# Altium schematic sheet Periferals.SchDoc
size A; SheetNumber: 2; SheetTotal: 2
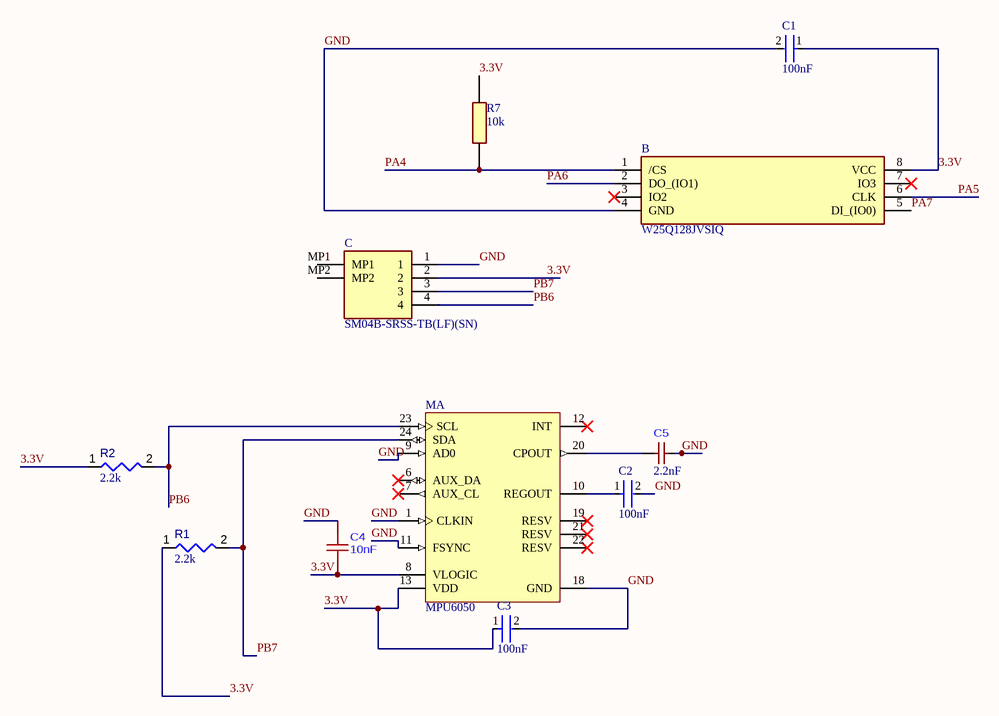
[diagram p0: Periferals.SchDoc]

## Parts
B  W25Q128JVSIQ  [SOIC127P790X216-8N]
C  SM04B-SRSS-TB(LF)(SN)  [SM04BSRSSTBLFSN]
C1  value 100nF  [FP-CC0603-DA-IPC_B]  (hidden comment: CC0603KRX7R9BB104)
C2  value 100nF  [FP-CC0603-DA-IPC_B]  (hidden comment: CC0603KRX7R9BB104)
C3  value 100nF  [FP-CC0603-DA-IPC_B]  (hidden comment: CC0603KRX7R9BB104)
C4  10nF  [PCBComponent_1]
C5  value 2.2nF  [PCBComponent_1]  (hidden comment: 0603B222K500NT)
M  MPU6050  [INSE-QFN-24_V]  (part A of 2)
R1  value 2.2k  [RESC0402(1005)_L]  (hidden comment: Resistor 2K2  +/-5 % 0402 63 mW)
R2  value 2.2k  [RESC0402(1005)_L]  (hidden comment: Resistor 2K2  +/-5 % 0402 63 mW)
R7  value 10k  [RESC1005X40N]  (hidden comment: 0402WGF1002TCE)

## Nets
3.3V: B.8(VCC) C.2 C1.1 C3.1 C4.1 M.8(VLOGIC) M.13(VDD) R1.1 R2.1 R7.2
GND: B.4(GND) C.1 C1.2 C2.2 C3.2 C4.2 C5.2 M.1(CLKIN) M.9(AD0) M.11(FSYNC) M.18(GND)
PA4: B.1(/CS) R7.1
PA5: B.6(CLK)
PA6: B.2(DO_(IO1))
PA7: B.5(DI_(IO0))
PB6: C.4 M.23(SCL) R2.2
PB7: C.3 M.24(SDA) R1.2
NetC2_1: C2.1 M.10(REGOUT)
NetC5_1: C5.1 M.20(CPOUT)

Not connected (* = marked no-connect by the designer): B 3(IO2)* 7(IO3)*; C MP1 MP2; M 6(AUX_DA)* 7(AUX_CL)* 12(INT)* 19(RESV)* 21(RESV)* 22(RESV)*

## Library data of the parts
B = CMP-00007-1: NOR Flash Serial (SPI, Dual SPI, Quad SPI) 3.3V 128M-bit 16M x 8 6ns 8-Pin SOIC Tube; Memory Size: 16MB; Nominal Supply Voltage (DC): 3V; Frequency: 104MHz; Number of Circuits: 1; Max Supply Voltage: 3.6V; Clock Frequency: 133MHz; Max Supply Current: 20mA; Min Supply Voltage: 2.7V; Export Control Classification Number (ECCN) Code: EAR99; China RoHS: Compliant; Case/Package: SOP; Max Operating Temperature: 85°C; Terminal Pitch: 1.27mm; Height - Seated (Max): 2.16mm; Min Operating Temperature: -40°C; Temperature Grade: Industrial; REACH SVHC: Yes; Lifecycle Status: Production; RoHS: Compliant; Number of Terminals: 8; Memory Format: FLASH; Harmonized Tariff Schedule (HTS) Code: 8542.32.00.51; Introduction Date: 2016-11-14; Ambient Temperature Range High: 85°C; Interface: Serial; Schedule B: 8542320070, 8542320070; Height: 2.16mm; Width: 5.23mm; Length: 5.23mm
C = CMP-00010-1: Connector Header, Side Entry, SR Series, 4 Position, 1.00mm, 50V, Surface Mount, Tin, Natural; Max Current Rating: 1A; Dielectric Material: Polyamide; Number of Positions: 4; Contact Resistance: 40mΩ; Pitch: 990.6µm; Connector Type: Male Pin; Gender: Male; Insulation Resistance: 100MΩ; Length: 6mm; Contact Plating: Tin; Orientation: Right Angle; Depth: 4.95mm; Packaging: Cut Tape; Max Operating Temperature: 85°C; Lifecycle Status: Production; Housing Material: Nylon; Lead Free: Lead Free; Mounting Technology: Surface Mount; Min Operating Temperature: -25°C; China RoHS: Compliant; Height: 2.9mm; Max Voltage Rating (AC): 50V; Current Rating: 1A; Pins: 2; Lead Pitch: 1mm; Color: Natural; Number of Contacts: 4; RoHS: Compliant; Width: 4.25mm; Voltage Rating: 50V; Housing Color: Natural; Termination: Solder; REACH SVHC: Yes; Number of Rows: 1; Max Voltage Rating (DC): 50V; Contact Material: Copper, Tin; Terminal Pitch: 1mm
C1-C3 = CMP-00034-1: Multilayer Ceramic Capacitor, CC Series, 0.1 - F, - 10%, X7R, 50 V, 0603 [1608 Metric]; Voltage Rating (DC): 50V; Schedule B: 8532240020, 8532240020; Harmonized Tariff Schedule (HTS) Code: 8532.24.00.20; Width: 800µm; RoHS: Compliant; Height: 800µm; Depth: 800µm; Termination: SMD/SMT; Lead Free: Lead Free; China RoHS: Compliant; Introduction Date: 2005-08-18; Dielectric: X7R; Case Code (Imperial): 0603; Export Control Classification Number (ECCN) Code: EAR99; Case/Package: 0603; Material: Ceramic; Number of Terminals: 2; Thickness: 889µm; Min Operating Temperature: -55°C; REACH SVHC: Yes; Mounting Technology: Surface Mount; Max Operating Temperature: 125°C; Dielectric Material: Ceramic; Halogen Free: Halogen Free; Voltage: 50V; Case Code (Metric): 1608; Length: 1.6mm; Lifecycle Status: Production; Tolerance: 10%; Voltage Rating: 50V; Radiation Hardening: No; Pins: 2; Country of Origin: Mainland China, Taiwan
C4 = CMP-00037-1: 50V 10nF X7R ±10% 0603 Multilayer Ceramic Capacitors MLCC - SMD/SMT ROHS; Number of Terminals: 2; Country of Origin: Mainland China; REACH SVHC: Yes; Introduction Date: 2005-06-22; Min Operating Temperature: -55°C; Value: 10nF; Voltage Rating (DC): 50V; Length: 1.6mm; Tolerance: 10%; Export Control Classification Number (ECCN) Code: EAR99; Mounting Technology: Surface Mount; Dielectric: X7R; Max Operating Temperature: 125°C; Case/Package: 0603; Harmonized Tariff Schedule (HTS) Code: 8532.24.00.20; Dielectric Material: Ceramic; Width: 800µm; Lifecycle Status: Production; Height: 800µm; RoHS: Compliant
C5 = CMP-00036-1: Ceramic Capacitor, Multilayer, Ceramic, 50V, 10% +Tol, 10% -Tol, X7R, 15% TC, 0.0022uF, Surface Mount, 0603; Harmonized Tariff Schedule (HTS) Code: 8532.24.00.20; Introduction Date: 2005-06-22; Voltage Rating (DC): 50V; REACH SVHC: Yes; Min Operating Temperature: -55°C; Height: 800µm; Max Operating Temperature: 125°C; Width: 800µm; Number of Terminals: 2; RoHS: Compliant; Export Control Classification Number (ECCN) Code: EAR99; Lifecycle Status: Production; Case/Package: 0603; Length: 1.6mm; Dielectric Material: Ceramic; Mounting Technology: Surface Mount; Country of Origin: Mainland China
M = CMP-010-00014-6: 3-Axis Gyroscope, 3-Axis Accelerometer, 2.375 to 3.46 V, -40 to 105 degC, 24-Pin QFN, RoHS, Tape and Reel; Manufacturer: InvenSense; Max Supply Voltage: 3.6V; Min Supply Voltage: 2.5V; Sensor Type: Motion; Interface: I2C; Min Operating Temperature: -40°C; Case/Package: QFN; Package Quantity: 5000; Pins: 24; RoHS Compliant: True; Packaging: CutTape; Datasheet URL: https://datasheet.ciiva.com/1513/1788002-1513632.pdf; Package Reference: QFN-24; Datasheet Version: Rev. 3.4, 08/2013; Package Description: 24-Pin Quad Flat No-lead Package, Body 4 x 4 mm, Pitch 0.5 mm; Max Operating Temperature: 85°C; Mounting Technology: SM
R1 R2 = CMP-009-00166-3: Chip Resistor, 2,2 kOhms, +/-5 %, 63 mW, -55 to 155 degC, 0402; Power: 63mW; Tolerance: 5%; Pins: 2; Min Operating Temperature: -55°C; Max Operating Temperature: 155°C; Case/Package: 0402
R7 = CMP-00018-1: Res Thick Film 0402 10K Ohm 1% 0.063W(1/16W) ±100ppm/C Pad SMD T/R; Temperature Coefficient: 100ppm/°C; Power Rating: 62.5mW; Working Voltage: 50V; Number of Terminals: 2; Max Operating Temperature: 155°C; Composition: Thick Film; Mounting Technology: Surface Mount; Width: 500µm; RoHS: Compliant; Length: 1mm; Height: 350µm; Min Operating Temperature: -55°C; REACH SVHC: Yes; Lifecycle Status: Production; Tolerance: 1%; China RoHS: Non-Compliant; Case/Package: 0402